# Altium schematic sheet MCU.SchDoc
size A4; DocumentNumber: 1; SheetNumber: 1
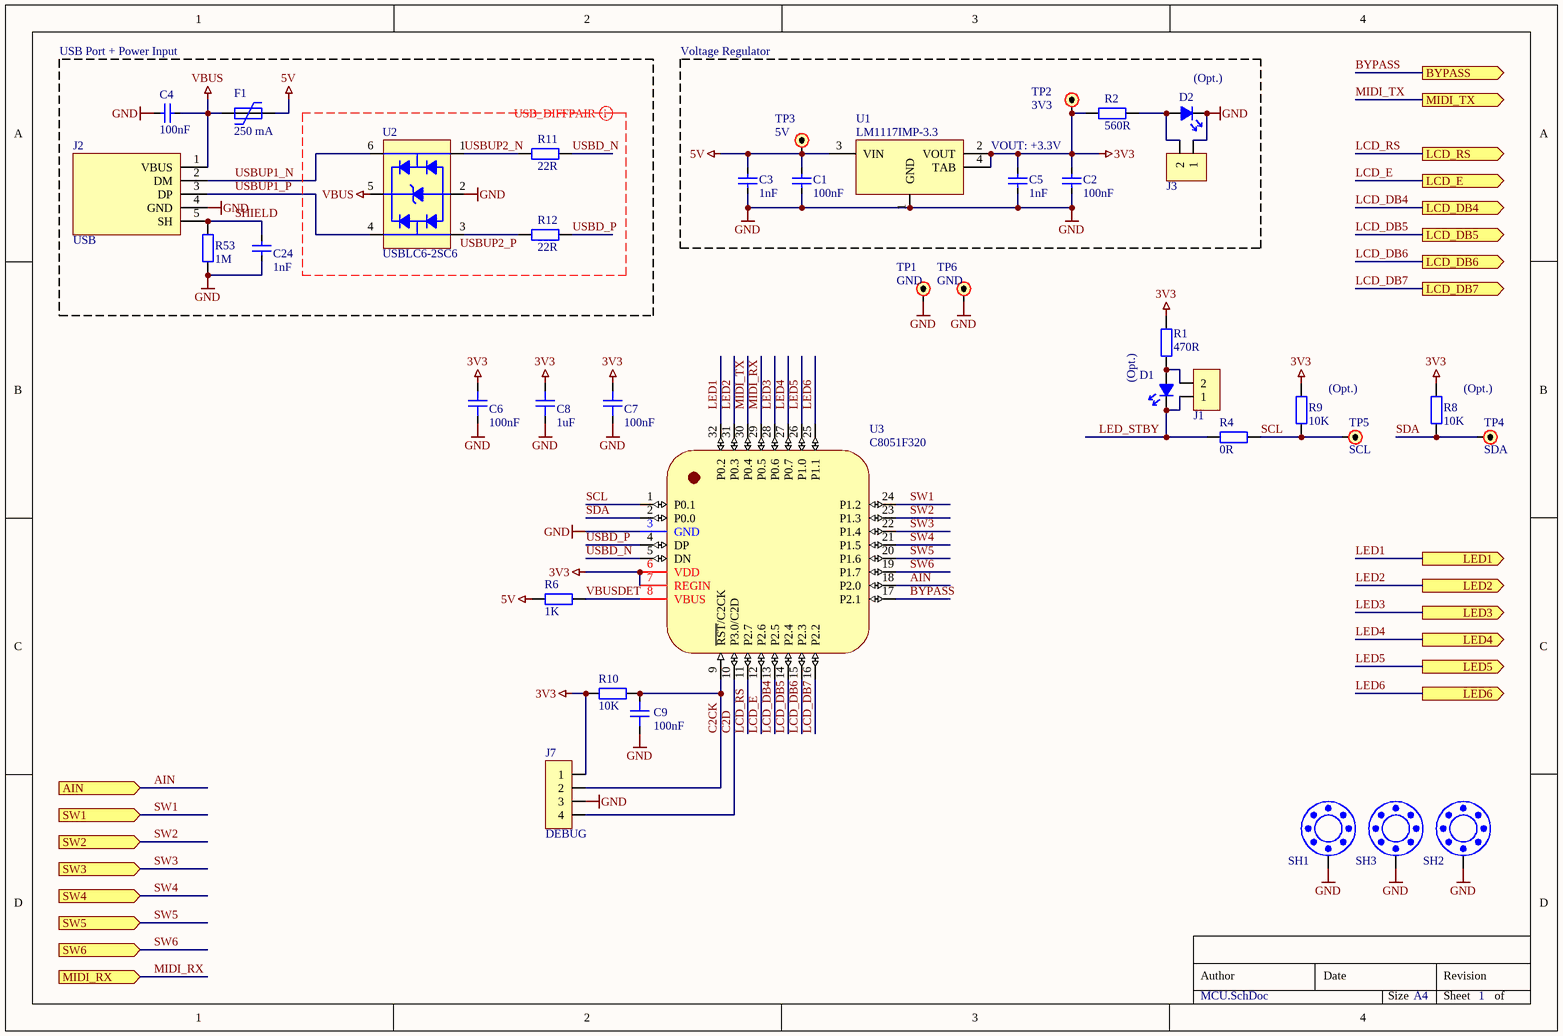
[diagram p0: MCU.SchDoc]

## Parts
C1  100nF  [0805C_RF_M]
C2  100nF  [0805C_RF_M]
C3  1nF  [0805C_RF_M]
C4  100nF  [1206C_RF_M]
C5  1nF  [0805C_RF_M]
C6  100nF  [0603C_RF_M]
C7  100nF  [0603C_RF_M]
C8  1uF  [0603C_RF_M]
C9  100nF  [0603C_RF_M]
C24  1nF  [0603C_RF_M]
D1  LED  [0805LED_RF_M]  (value not drawn)
D2  LED  [0805LED_RF_M]  (value not drawn)
F1  250 mA  [BOURNS_MF-MSMF110/16-2_RF_H]
J1  LED  [HEADER-2.54-2P1]  (value not drawn)
J2  USB  [UJ2-BH-2-TH]
J3  PINHDR_2x1  [HEADER-2.54-2P1]  (value not drawn)
J7  DEBUG  [HEADER-2.54-4P1]
R1  470R  [0603R_RF_M]
R2  560R  [0603R_RF_M]
R4  0R  [0603R_RF_M]
R6  1K  [0805R_RF_M]
R8  10K  [0603R_RF_M]
R9  10K  [0603R_RF_M]
R10  10K  [0603R_RF_M]
R11  22R  [0603R_RF_M]
R12  22R  [0603R_RF_M]
R53  1M  [0603R_RF_M]
SH1  SH-30/57  [SH\D3.0\S5.7]  (value not drawn)
SH2  SH-30/57  [SH\D3.0\S5.7]  (value not drawn)
SH3  SH-30/57  [SH\D3.0\S5.7]  (value not drawn)
TP1  GND  [PAD_R_1.5MM]
TP2  3V3  [PAD_R_1.5MM]
TP3  5V  [PAD_R_1.5MM]
TP4  SDA  [PAD_R_1MM]
TP5  SCL  [PAD_R_1MM]
TP6  GND  [PAD_R_1.5MM]
U1  LM1117IMP-3.3  VOUT: +3.3V  [SOT-223]
U2  USBLC6-2SC6  [TI_SOT-23-6]
U3  C8051F320  [LQFP-32]

## Blocks framed on the sheet
USB Port + Power Input: C4 C24 F1 J2 R11 R12 R53 U2

## Ports
AIN (in), BYPASS (out), LCD_DB4 (out), LCD_DB5 (out), LCD_DB6 (out), LCD_DB7 (out), LCD_E (out), LCD_RS (out), LED1 (out), LED2 (out), LED3 (out), LED4 (out), LED5 (out), LED6 (out), MIDI_RX (in), MIDI_TX (out), SW1 (in), SW2 (in), SW3 (in), SW4 (in), SW5 (in), SW6 (in)

## Nets
3V3: C2.2 C5.2 C6.2 C7.2 C8.2 J7.1 R1.2 R2.2 R8.2 R9.2 R10.1 TP2.1 U1.2(VOUT) U1.4(TAB) U3.6(VDD) U3.7(REGIN)
5V: C1.2 C3.2 F1.2 R6.2 TP3.1 U1.3(VIN)
GND: C1.1 C2.1 C3.1 C4.2 C5.1 C6.1 C7.1 C8.1 C9.1 C24.1 D2.C J2.4(GND) J3.1 J7.3 R53.1 SH1.1 SH2.1 SH3.1 TP1.1 TP6.1 U1.1(GND) U2.2 U3.3(GND)
VBUS: C4.1 F1.1 J2.1(VBUS) U2.5
AIN: U3.18(P2.0) ; port AIN
BYPASS: U3.17(P2.1) ; port BYPASS
C2CK: C9.2 J7.2 R10.2 U3.9(~{RST}/C2CK)
C2D: J7.4 U3.10(P3.0/C2D)
LCD_DB4: U3.13(P2.5) ; port LCD_DB4
LCD_DB5: U3.14(P2.4) ; port LCD_DB5
LCD_DB6: U3.15(P2.3) ; port LCD_DB6
LCD_DB7: U3.16(P2.2) ; port LCD_DB7
LCD_E: U3.12(P2.6) ; port LCD_E
LCD_RS: U3.11(P2.7) ; port LCD_RS
LED1: U3.32(P0.2) ; port LED1
LED2: U3.31(P0.3) ; port LED2
LED3: U3.28(P0.6) ; port LED3
LED4: U3.27(P0.7) ; port LED4
LED5: U3.26(P1.0) ; port LED5
LED6: U3.25(P1.1) ; port LED6
LED_STBY: D1.C J1.1 R4.2
MIDI_RX: U3.29(P0.5) ; port MIDI_RX
MIDI_TX: U3.30(P0.4) ; port MIDI_TX
SCL: R4.1 R9.1 TP5.1 U3.1(P0.1)
SDA: R8.1 TP4.1 U3.2(P0.0)
SHIELD: C24.2 J2.5(SH) R53.2
SW1: U3.24(P1.2) ; port SW1
SW2: U3.23(P1.3) ; port SW2
SW3: U3.22(P1.4) ; port SW3
SW4: U3.21(P1.5) ; port SW4
SW5: U3.20(P1.6) ; port SW5
SW6: U3.19(P1.7) ; port SW6
USBD_N: R11.1 U3.5(DN)
USBD_P: R12.1 U3.4(DP)
USBUP1_N: J2.2(DM) U2.6
USBUP1_P: J2.3(DP) U2.4
USBUP2_N: R11.2 U2.1
USBUP2_P: R12.2 U2.3
VBUSDET: R6.1 U3.8(VBUS)
NetD1_A: D1.A J1.2 R1.1
NetD2_A: D2.A J3.2 R2.1

## Layout directives
differential pair: GND, USBD_N, USBD_P, USBUP2_N, USBUP2_P, VBUS

## Notes on the sheet
- Voltage Regulator
- (near D2) (Opt.)
- (Opt.)
- Author
- Date
- Revision
- Size
- A4
- Sheet
- of

## Library data of the parts
C1-C9 C24 = C: Capacitor; Manufacturer: Generic Brand; Max Voltage: ? V; Tolerance: ?; Manufacturer Part No: *; Supplier: *; Supplier Link: http://; Supplier Part No: *; Category: Capacitor; Mounting Technology: SMT
  C1 C2 C4 C6 C7 C9: Value: 100nF
  C3 C5 C24: Value: 1nF
  C8: Value: 1uF
D1 D2 = LED: Manufacturer: Generic Brand; Emitting Color: Unspecified; Forward Voltage Drop: ? V; Manufacturer Part No: *; Supplier: *; Supplier Link: http://; Supplier Part No: *; Mounting Technology: SMT; Category: Diode
F1 = PPTC: Resettable Fuse; Manufacturer: Generic Brand; Max Voltage: ? V; Hold Current: 250 mA; Category: Fuse; Mounting Technology: SMT; Supplier Link: http://
J1 J3 = PINHDR_2x1: Generic Pin Header 2x1
J2 = USBB-1J: USB Type B Receptacle; pin to pad: 5>SH; Manufacturer: Connfly; Product Number: USBB-1J (DS1099-WN0); Mounting Type: THT; Case: USB Type B; Supplier: Chipdip; Supplier Link: https://www.chipdip.by/product/usbb-1j; Supplier Part No: 249636968
J7 = PINHDR_4x1: Generic Pin Header 4x1
R1 R2 R4 R6 R8-R12 R53 = R: Resistor; Manufacturer: Generic Brand; Max Voltage: ? V; Power Rating: ? W; Tolerance: ?; Manufacturer Part No: *; Supplier: *; Supplier Link: http://; Supplier Part No: *; Category: Resistor; Mounting Technology: SMT
  R1: Value: 470R
  R2: Value: 560R
  R4: Value: 0R
  R6: Value: 1K
  R8-R10: Value: 10K
  R11 R12: Value: 22R
  R53: Value: 1M
SH1-SH3 = SH-30/57: Screw Hole D3.0/5.7 T/B
TP1-TP6 = TP: Test Point / Pad
U1 = LM1117: Voltage Regulator Linear 1% 800mA SOT-223; Manufacturer: Texas Instruments; VIN_MAX: +15V; Case: SOT-223; Product Number: LM1117IMP-3.3; Supplier: Chipdip; Supplier Link: https://www.chipdip.by/product/lm1117imp-3.3-nopb-2; Supplier Part No: 5641124530; Mounting Type: SMT
U2 = USBLC6-2SC6: Low Capacitance USB ESD Protection; Manufacturer: STMicroelectronics; Supplier Link: https://www.chipdip.by/product/usblc6-2sc6; Supplier Part No: 9000039051; Supplier: Chipdip; Case: SOT-23-6; Mounting Type: SMT; Product Name: USBLC6-2SC6
U3 = C8051F320: IC MCU 8BIT 16KB FLASH 32LQFP; Manufacturer: Silicon Labs; Manufacturer Part No: C8051F320-GQR; Mounting Technology: SMT; Package: LQFP-32; Supplier: DigiKey; Supplier Link: https://www.digikey.com/en/products/detail/silicon-labs/C8051F320-GQR/990799; Supplier Part No: C8051F320-GQRCT-ND; Alternative Supplier: Chipdip; Alternative Supplier Link: https://www.chipdip.by/product/c8051f320-gqr; Alternative Supplier Part No: 1108753860